# Altium schematic sheet voeding.SchDoc
size A4; SheetNumber: 5; SheetTotal: 5
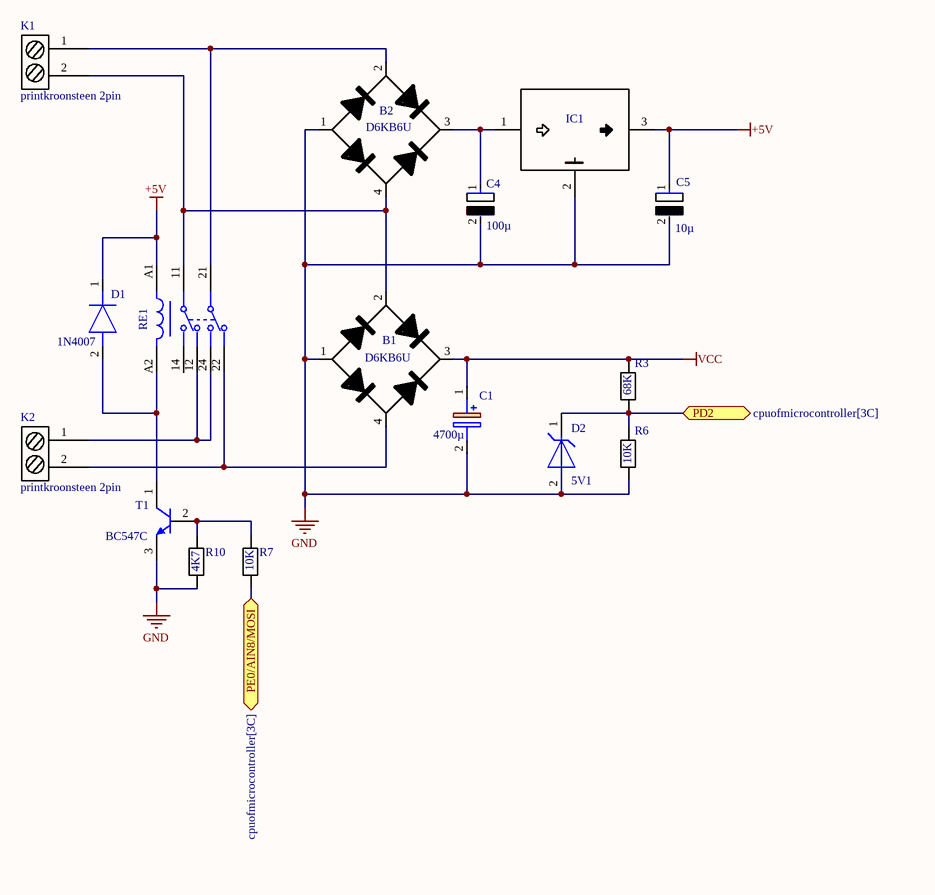
[diagram p0: voeding.SchDoc]

## Parts
B1  D6KB6U  [D6KB6U]
B2  D6KB6U  [D6KB6U]
C1  4700µ  [CAPPRD1000W80D2200H3700]
C4  100µ  [100uF/50v aluminum electrolytic capacitor]
C5  10µ  [RESC2013X50X30LL20T20]
D1  1N4007  [DIOAD1405W86L465D235]
D2  5V1  [FP-SOD123-IPC_A]
IC1  (no value)  [MURA-OKI-78SR-3]
K1  printkroonsteen 2pin  [printkroonsteen 2pin]
K2  printkroonsteen 2pin  [printkroonsteen 2pin]
R3  68K  [RESC2013X50X30LL20T20]
R6  10K  [RESC2013X50X30LL20T20]
R7  10K  [RESC2013X50X30LL20T20]
R10  4K7  [RESC2013X50X30LL20T20]
RE1  (no value)  [FP-RT424005-MFG]
T1  BC547C  [ONSC-TO-92-3-29-11]

## Ports
PD2 (bidir, see cpuofmicrocontroller[3C]), PE0/AIN8/MOSI (bidir, see cpuofmicrocontroller[3C])

## Nets
+5V: C5.1 D1.1(K) IC1.3 RE1.A1
GND: B1.1 B2.1 C1.2(-) C4.2 C5.2 D2.2(A) IC1.2(COMMON) R6.1 R10.1 T1.3(E)
VCC: B1.3 C1.1(+) R3.2
PD2: D2.1(C) R3.1 R6.2 ; port PD2
PE0/AIN8/MOSI: R7.1 ; port PE0/AIN8/MOSI
NetB1_2: B1.2 B2.4 K1.2 RE1.11
NetB1_4: B1.4 K2.2 RE1.22
NetB2_2: B2.2 K1.1 RE1.21
NetB2_3: B2.3 C4.1 IC1.1
NetD1_2: D1.2(A) RE1.A2 T1.1(C)
NetK2_1: K2.1 RE1.12 RE1.24
NetR7_2: R7.2 R10.2 T1.2(B)

Not connected (* = marked no-connect by the designer): RE1 14

## Library data of the parts
C1 = CondensatorGroot: Capacitor Polarised; Manufacturer_Name: KEMET; Manufacturer_Part_Number: ESK478M050AQ3AA; Datasheet Link: https://content.kemet.com/datasheets/KEM_A4004_ESK.pdf; Height: 37mm; Mouser Part Number: 80-ESK478M050AQ3AA; Mouser Price/Stock: https://www.mouser.co.uk/ProductDetail/KEMET/ESK478M050AQ3AA?qs=gt1LBUVyoHl7SM9dsUCJjA%3D%3D
C4 C5 = Capacitor: CAP CER 0.1UF 10V X5R 0402; Manufacturer: Kemet; Manufacturer Part Number: C0402C104K8PACTU; Material: Ceramic; Capacitance: 0.10 μF; Temperature Coefficient: 15%; Tolerance: 0.1; Value: 0.10 μF; Package: C0402-BB; Temperature: -55°C to +125°C; ComponentLink2Description: Datasheet; Temperature Characteristic: X5R; Device Class L1: Passive Components; Height: 0.55mm; Lead Free: Yes; ComponentLink2URL: https://content.kemet.com/datasheets/KEM_C1002_X7R_SMD.pdf; Device Class L2: Capacitors; Temperature Range Low: -55°C; Temperature Range High: +125°C; RoHS: TRUE; Octopart: https://octopart.com/c0402c104k8pactu-kemet-140039; Automotive: No; Mouser Description: Capacitor 100 nF 10 VDC 0402 | KEMET C0402C104K8PACTU (Capacitor 100 nF 10 VDC 0402 Ceramic Capacitors).; Category: Cap; Voltage Rating: 10 V; Digikey Description: CAP CER 0.1UF 10V X5R 0402; Ipc Land Pattern Name: CAPC10050X50; Device Class L3: Ceramic Capacitors
D1 = 1N4007-E3_73: Diode; Manufacturer_Name: Vishay; Manufacturer_Part_Number: 1N4007-E3/73; Datasheet Link: https://mouser.componentsearchengine.com/Datasheets/2/1N4007-E3_73.pdf; Mouser Part Number: 625-1N4007-E3/73; Mouser Price/Stock: https://www.mouser.co.uk/ProductDetail/Vishay-General-Semiconductor/1N4007-E3-73?qs=N4vtoAxH%2FSqT3Ng3e4K0Gw%3D%3D; Arrow Part Number: 1N4007-E3/73; Arrow Price/Stock: https://www.arrow.com/en/products/1n4007-e373/vishay?region=europe
D2 = Zenerdiode: DIODE ZENER 5.1V 500MW SOD123; Manufacturer Part Number: BZT52C5V1-7-F; Manufacturer: Diodes Incorporated; Standoff Height: 0mm; Max Reverse Leakage Current: 2uA; Forward Current: 10mA; Power Dissipation: 370mW; Max Zener Voltage: 5.4V; Zener Impedance: 60Ω; Automotive Grade: NA; Max Junction Temp: +150°C; Device Class L3: Zener Diodes; ComponentLink2Description: Datasheet; Mouser Description: Zener Diodes 5.1V 500mW; Octopart: https://octopart.com/bzt52c5v1-7-f-diodes+inc.-326718; Package: SOD123; RoHS: TRUE; Nom Zener Voltage: 5.1V; Device Class L1: Discrete Semiconductors; Lead Free: Yes; Footprint Url: https://www.diodes.com/assets/Package-Files/SOD123.pdf; ComponentLink2URL: https://www.diodes.com/assets/Datasheets/ds18004.pdf; Digikey Description: DIODE ZENER 5.1V 500MW SOD123; Height: 1.45mm; Temperature Range Low: -65°C; Device Class L2: Diodes; Temperature: -65°C to +150°C; Automotive: No; Temperature Range High: +150°C; Category: Diode
IC1 = OKI-78SR-5/1.5-W36-C: Non-Isolated DC/DC Converter, 7.5 W, 7 to 36 V, 1.5 A, -40 to 85 degC, 3-Pin THD, RoHS; Manufacturer: Murata; Current - Output (Max): 1.5A; Power (Watts) - Max: 8W; Efficiency: 90.5%; Voltage - Input (Min): 7V; Voltage - Input (Max): 36V; Voltage - Output 1: 5V; Number of Outputs: 1; Package / Case: 3-SIPModule; Features: SCP; Type: LinearRegulatorReplacement; Size / Dimension: 0.41"Lx0.30"Wx0.65"H(10.4mmx7.6mmx16.5mm); Datasheet URL: https://datasheet.ciiva.com/8006/1790439-8006672.pdf; Datasheet Version: Oct-13; Power (Watts) - Manufacture Series: 8W; Voltage - Output 2: -; Series: Okami™OKI-78SR; Family: DCDCConverters; Manufacturer URL: http://www.murata.com/; Category: PowerSupplies-BoardMount; Voltage - Isolation: -; Packaging: Tube; Applications: ITE(Commercial); Mounting Type: ThroughHole; Voltage - Output 3: -; Operating Temperature: -40degC~85degC
R3 R6 R7 R10 = weerstand: Manufacturer: Vishay Dale; Part Number: CRCW08050000Z0EA
RE1 = RT424005: RELAY GENERAL PURPOSE DPDT 8A 5V; Manufacturer: TE Connectivity; Coil Power: 403mW; Number Of Contacts: 2; Coil Resistance: 62Ω; Coil Type: Non-Latching; Manufacturer Part Number: RT424005; Category: Relay; Octopart: https://octopart.com/5-1393243-9-te+connectivity-41835766; Device Class L3: Power Relays; ComponentLink2URL: https://www.te.com/commerce/DocumentDelivery/DDEController?Action=showdoc&DocId=Data+Sheet%7FRT2%7F1014%7Fpdf%7FEnglish%7FENG_DS_RT2_1014.pdf%7F5-1393243-9; Ambient Temperature Range High: +85°C; ComponentLink2Description: Datasheet; Throw Configuration: DPDT; Digikey Description: RELAY GENERAL PURPOSE DPDT 8A 5V; Package: RT424005; Automotive: No; Device Class L1: Electromechanical; Height: 15.7mm; Device Class L2: Relays; Ambient Temperature Range Low: -40°C; Coil Voltage: 5V; Current Rating: 8A; Mouser Description: General Purpose Relay, Rt2 Series, Power, Non Latching, Dpdt, 5 Vdc, 8 A Rohs Compliant: Yes; Lead Free: Yes; RoHS: TRUE
T1 = BC547C: Amplifier Transistor, NPN Silicon, 3-Pin TO-92, Bulk Box; Manufacturer: On Semiconductor; IC Continuous (A): 0.1; fT Min (MHz): 150; Mounting Technology: Through Hole; ComponentLink1URL: http://www.onsemi.com/; ComponentLink1Description: Manufacturer URL; ComponentLink3URL: http://www.onsemi.cn/pub_link/Collateral/2N6426-D.PDF; DatasheetVersion: Rev. 7; PackageVersion: Rev. AM; Packing: Bulk Box; RoHS: FALSE; Polarity: NPN; PartNumber: BC547C; ComponentLink2URL: http://www.onsemi.com/pub_link/Collateral/BC546-D.PDF; ComponentLink3Description: Package Specification; PackageDescription: 3-Pin Transistor Outline, Body 4.825 x 3.685 mm, Pitch 1.27 mm; PackageReference: TO-92-3-29-11_AM_SL; ComponentLink2Description: Datasheet